# EAGLE design md_ver10.7 (EAGLE 6.4)
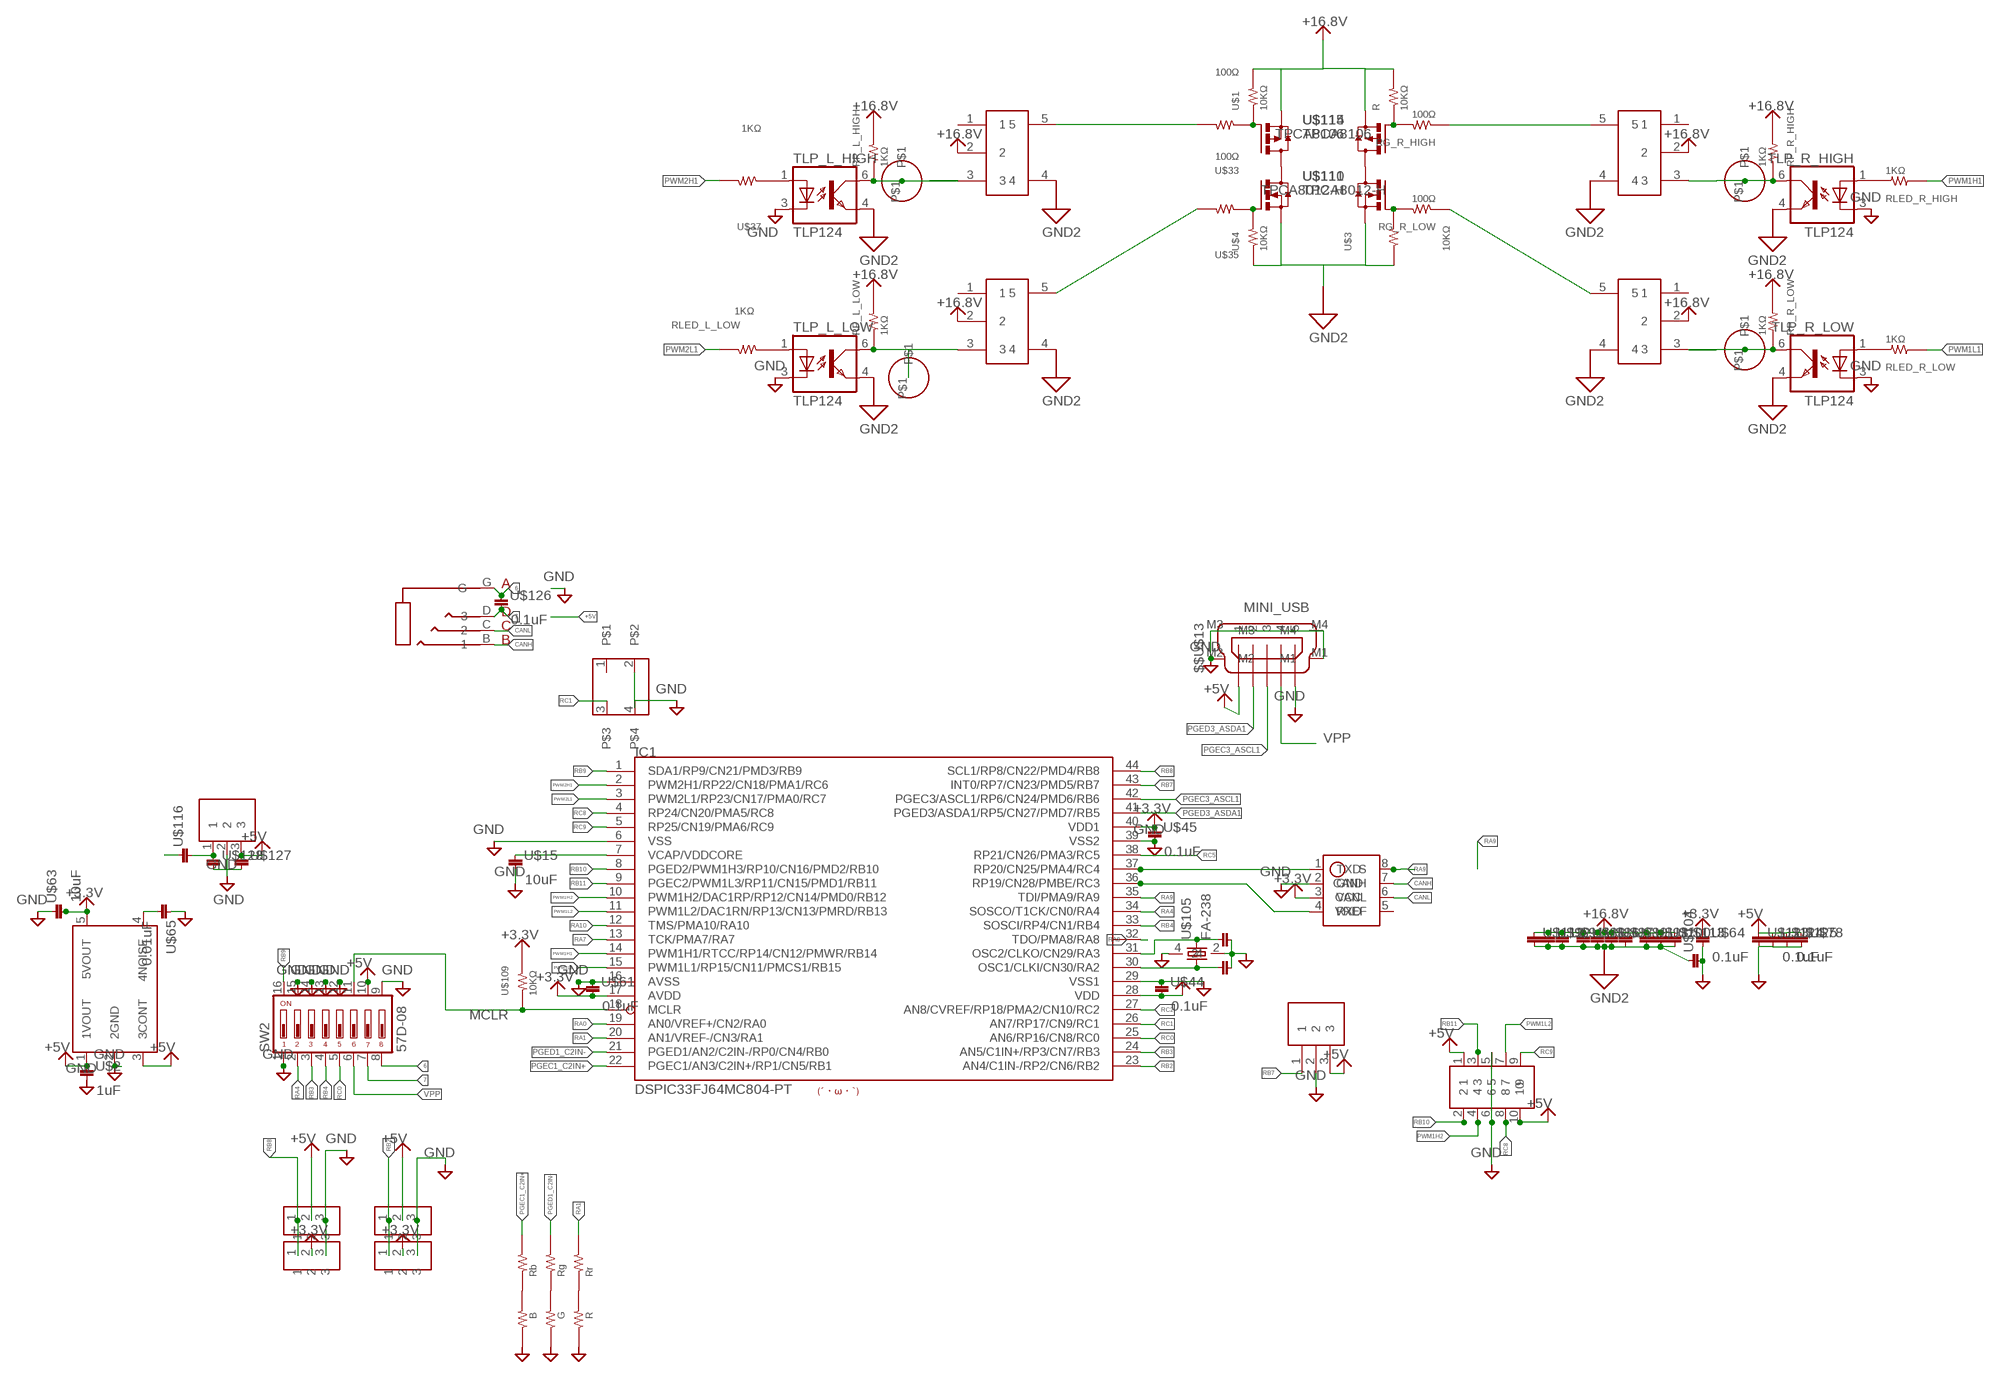
[diagram p0: schematic, sheet 1]

## Parts
$$U$5  PAD1_4MM  [PAD1_4MM]
$$U$6  PAD1_4MM  [PAD1_4MM]
$$U$13  MINI_USB  [MINI_USB]
$$U$14  AUDIO4  [AUDIO4_MJ]
$$U$102  1608  [1608]
$$U$108  Rr  RESISTOR__SMD  [1608]
IC1  DSPIC33FJ64MC804-PT  [TQFP44]
IC2  TAR5SB  [SSOP5-P-0.95]
IC3  SN65HVD1050  [SOIC8]
IC4  ＰＬ－ＩＲＭ  [ＰＬ－ＩＲＭ]
IC5  Ｒ－７８Ｅ５．０  [Ｒ－７８Ｅ５．０]
IC_L_HIGH  MCP1415  [SOT23-5L]
IC_L_LOW  MCP1415  [SOT23-5L]
IC_R_HIGH  MCP1415  [SOT23-5L]
IC_R_LOW  MCP1415  [SOT23-5L]
R  10KΩ  RESISTOR__SMD  [1608]
RG_R_HIGH  100Ω  RESISTOR__SMD  [1608]
RG_R_LOW  100Ω  RESISTOR__SMD  [1608]
RLED_L_LOW  1KΩ  RESISTOR__SMD  [1608]
RLED_R_HIGH  1KΩ  RESISTOR__SMD  [1608]
RLED_R_LOW  1KΩ  RESISTOR__SMD  [1608]
RP_L_HIGH  1KΩ  RESISTOR__SMD  [1608]
RP_L_LOW  1KΩ  RESISTOR__SMD  [1608]
RP_R_HIGH  1KΩ  RESISTOR__SMD  [1608]
RP_R_LOW  1KΩ  RESISTOR__SMD  [1608]
SW1  TACT  [TL1105]
SW2  57D-08  [57D]
TLP_L_HIGH  TLP124  [11−4C1]
TLP_L_LOW  TLP124  [11−4C1]
TLP_R_HIGH  TLP124  [11−4C1]
TLP_R_LOW  TLP124  [11−4C1]
U$1  10KΩ  RESISTOR__SMD  [1608]
U$2  1uF  1608  [1608]
U$3  10KΩ  RESISTOR__SMD  [1608]
U$4  10KΩ  RESISTOR__SMD  [1608]
U$7  PAD1_4MM  [PAD1_4MM]
U$8  PAD1_4MM  [PAD1_4MM]
U$9  PIN_HEADER_52  [PIN_HEADER_5*2]
U$10  R  RESISTOR__SMD  [1608]
U$11  G  RESISTOR__SMD  [1608]
U$12  B  RESISTOR__SMD  [1608]
U$15  10uF  2012  [2012]
U$33  100Ω  RESISTOR__SMD  [1608]
U$35  100Ω  RESISTOR__SMD  [1608]
U$37  1KΩ  RESISTOR__SMD  [1608]
U$44  0.1uF  1608  [1608]
U$45  0.1uF  1608  [1608]
U$61  0.1uF  1608  [1608]
U$63  10uF  2012  [2012]
U$64  0.1uF  1608  [1608]
U$65  0.01uF  1608  [1608]
U$69  3PIN_HALF  [3PIN_INT_HALF]
U$75  3PIN_HALF  [3PIN_INT_HALF]
U$78  1608  [1608]
U$86  3225  [3225]
U$87  3225  [3225]
U$88  3225  [3225]
U$89  3225  [3225]
U$91  1608  [1608]
U$92  1608  [1608]
U$93  1608  [1608]
U$100  1608  [1608]
U$103  1608  [1608]
U$104  2012  [2012]
U$105  FA-238  [FA-238]
U$106  Rb  RESISTOR__SMD  [1608]
U$107  Rg  RESISTOR__SMD  [1608]
U$109  10KΩ  RESISTOR__SMD  [1608]
U$110  TPCA8012-H  [2-5Q1A]
U$111  TPCA8012-H  [2-5Q1A]
U$112  1608  [1608]
U$113  1608  [1608]
U$114  TPCA8106  [2-5Q1A]
U$115  TPCA8106  [2-5Q1A]
U$116  2012  [2012]
U$117  3PIN_HALF  [3PIN_INT_HALF]
U$118  3PIN_HALF  [3PIN_INT_HALF]
U$123  1608  [1608]
U$124  0.1uF  1608  [1608]
U$125  0.1uF  1608  [1608]
U$126  0.1uF  1608  [1608]
U$127  3216  [3216]
U$128  1608  [1608]
U$129  ROGO_SYOBON  [ROGO_SYOBON]

## Nets
6: $$U$14.G SW2.8 U$126.P$1
7: $$U$14.D SW2.7 U$126.P$2
+3.3V: IC1.17(AVDD) IC1.28(VDD) IC1.40(VDD1) IC2.5(5VOUT) IC3.3(VCC) U$44.P$2 U$45.P$1 U$61.P$2 U$63.2 U$64.P$1 U$69.2 U$75.2 U$109.2
+5V: $$U$13.1 IC2.1(1VOUT) IC2.3(3CONT) IC4.3 IC5.3 SW2.10 U$2.P$1 U$9.1 U$9.10 U$78.P$1 U$117.2 U$118.2 U$123.P$1 U$124.P$1 U$125.P$1 U$127.P$1
+16.8V: IC_L_HIGH.2 IC_L_LOW.2 IC_R_HIGH.2 IC_R_LOW.2 R.2 RP_L_HIGH.2 RP_L_LOW.2 RP_R_HIGH.2 RP_R_LOW.2 U$1.2 U$86.P$1 U$87.P$1 U$88.P$1 U$89.P$1 U$91.P$1 U$92.P$1 U$93.P$1 U$100.P$1 U$112.P$1 U$113.P$1 U$114.1(S) U$114.2(S) U$114.3(S) U$115.1(S) U$115.2(S) U$115.3(S)
CANH: $$U$14.B IC3.7(CANH)
CANL: $$U$14.C IC3.6(CANL)
GND: $$U$13.5 $$U$13.M1 $$U$13.M2 $$U$13.M3 $$U$13.M4 $$U$102.P$2 IC1.6(VSS) IC1.16(AVSS) IC1.29(VSS1) IC1.39(VSS2) IC2.2(2GND) IC3.2(GND) IC4.2 IC5.2 SW1.2 SW1.4 SW2.1 SW2.9 SW2.12 SW2.13 SW2.14 SW2.15 TLP_L_HIGH.3(C) TLP_L_LOW.3(C) TLP_R_HIGH.3(C) TLP_R_LOW.3(C) U$2.P$2 U$9.5 U$9.6 U$10.1 U$11.1 U$12.1 U$15.2 U$44.P$1 U$45.P$2 U$61.P$1 U$63.1 U$64.P$2 U$65.P$1 U$69.3 U$75.3 U$78.P$2 U$103.P$2 U$104.2 U$105.2 U$105.4 U$117.3 U$118.3 U$123.P$2 U$124.P$2 U$125.P$2 U$127.P$2 U$128.P$2
GND2: IC_L_HIGH.4 IC_L_LOW.4 IC_R_HIGH.4 IC_R_LOW.4 TLP_L_HIGH.4(EMIT) TLP_L_LOW.4(EMIT) TLP_R_HIGH.4(EMIT) TLP_R_LOW.4(EMIT) U$3.1 U$4.1 U$86.P$2 U$87.P$2 U$88.P$2 U$89.P$2 U$91.P$2 U$92.P$2 U$93.P$2 U$100.P$2 U$104.1 U$110.1(S) U$110.2(S) U$110.3(S) U$111.1(S) U$111.2(S) U$111.3(S) U$112.P$2 U$113.P$2
JP1: U$116.1
M1: U$111.5(D) U$111.6(D) U$111.7(D) U$111.8(D) U$115.5(D) U$115.6(D) U$115.7(D) U$115.8(D)
M2: U$110.5(D) U$110.6(D) U$110.7(D) U$110.8(D) U$114.5(D) U$114.6(D) U$114.7(D) U$114.8(D)
MCLR: IC1.18(MCLR) SW2.11 U$109.1
N$1: U$4.2 U$35.1 U$111.4(G)
N$2: IC2.4(4NOISE) U$65.P$2
N$3: RLED_L_LOW.1 TLP_L_LOW.1(A)
N$4: RG_R_LOW.2 U$3.2 U$110.4(G)
N$5: IC_L_HIGH.5 U$33.2
N$6: $$U$6.P$1 IC_L_LOW.3 RP_L_LOW.1 TLP_L_LOW.6(COL)
N$7: IC_R_LOW.5 RG_R_LOW.1
N$9: RLED_R_LOW.1 TLP_R_LOW.1(A)
N$10: TLP_L_HIGH.1(A) U$37.1
N$11: $$U$5.P$1 IC_L_HIGH.3 RP_L_HIGH.1 TLP_L_HIGH.6(COL)
N$12: $$U$102.P$1 IC1.30(OSC1/CLKI/CN30/RA2) U$105.1
N$13: IC5.1 U$116.2 U$128.P$1
N$14: IC_L_LOW.5 U$35.2
N$15: IC_R_HIGH.3 RP_R_HIGH.1 TLP_R_HIGH.6(COL) U$8.P$1
N$16: RLED_R_HIGH.1 TLP_R_HIGH.1(A)
N$18: IC_R_HIGH.5 RG_R_HIGH.1
N$19: U$1.1 U$33.1 U$115.4(G)
N$20: R.1 RG_R_HIGH.2 U$114.4(G)
N$21: U$12.2 U$106.1
N$23: IC1.31(OSC2/CLKO/CN29/RA3) U$103.P$1 U$105.3
N$24: U$11.2 U$107.1
N$25: $$U$108.1 U$10.2
N$27: IC1.37(RP20/CN25/PMA4/RC4) IC3.1(TXD)
N$30: IC1.36(RP19/CN28/PMBE/RC3) IC3.4(RXD)
PGEC1_C2IN+: IC1.22(PGEC1/AN3/C2IN+/RP1/CN5/RB1) U$106.2
PGEC3_ASCL1: $$U$13.3 IC1.42(PGEC3/ASCL1/RP6/CN24/PMD6/RB6)
PGED1_C2IN-: IC1.21(PGED1/AN2/C2IN-/RP0/CN4/RB0) U$107.2
PGED3_ASDA1: $$U$13.2 IC1.41(PGED3/ASDA1/RP5/CN27/PMD7/RB5)
PWM1H1: IC1.14(PWM1H1/RTCC/RP14/CN12/PMWR/RB14) RLED_R_HIGH.2
PWM1H2: IC1.10(PWM1H2/DAC1RP/RP12/CN14/PMD0/RB12) U$9.4
PWM1L1: IC1.15(PWM1L1/RP15/CN11/PMCS1/RB15) RLED_R_LOW.2
PWM1L2: IC1.11(PWM1L2/DAC1RN/RP13/CN13/PMRD/RB13) U$9.7
PWM2H1: IC1.2(PWM2H1/RP22/CN18/PMA1/RC6) U$37.2
PWM2L1: IC1.3(PWM2L1/RP23/CN17/PMA0/RC7) RLED_L_LOW.2
RA0: IC1.19(AN0/VREF+/CN2/RA0)
RA1: $$U$108.2 IC1.20(AN1/VREF-/CN3/RA1)
RA4: IC1.34(SOSCO/T1CK/CN0/RA4) SW2.2
RA7: IC1.13(TCK/PMA7/RA7)
RA8: IC1.32(TDO/PMA8/RA8)
RA9: IC1.35(TDI/PMA9/RA9) IC3.8(S)
RA10: IC1.12(TMS/PMA10/RA10)
RB2: IC1.23(AN4/C1IN-/RP2/CN6/RB2) U$75.1 U$118.1
RB3: IC1.24(AN5/C1IN+/RP3/CN7/RB3) SW2.3
RB4: IC1.33(SOSCI/RP4/CN1/RB4) SW2.4
RB7: IC1.43(INT0/RP7/CN23/PMD5/RB7) IC4.1
RB8: IC1.44(SCL1/RP8/CN22/PMD4/RB8) U$69.1 U$117.1
RB9: IC1.1(SDA1/RP9/CN21/PMD3/RB9) SW2.16
RB10: IC1.8(PGED2/PWM1H3/RP10/CN16/PMD2/RB10) U$9.2
RB11: IC1.9(PGEC2/PWM1L3/RP11/CN15/PMD1/RB11) U$9.3
RC0: IC1.25(AN6/RP16/CN8/RC0) SW2.5
RC1: IC1.26(AN7/RP17/CN9/RC1) SW1.3
RC2: IC1.27(AN8/CVREF/RP18/PMA2/CN10/RC2)
RC5: IC1.38(RP21/CN26/PMA3/RC5)
RC8: IC1.4(RP24/CN20/PMA5/RC8) U$9.8
RC9: IC1.5(RP25/CN19/PMA6/RC9) U$9.9
TLP_R_LOW: IC_R_LOW.3 RP_R_LOW.1 TLP_R_LOW.6(COL) U$7.P$1
VCAP/VDDCORE: IC1.7(VCAP/VDDCORE) U$15.1
VPP: $$U$13.4 SW2.6
Unconnected: IC3.5(VREF) IC_L_HIGH.1 IC_L_LOW.1 IC_R_HIGH.1 IC_R_LOW.1 SW1.1

## Library data of the parts
$$U$5 $$U$6 U$7 U$8 = 08_CONECTOR:PAD1_4MM
$$U$13 = 08_CONECTOR:MINI_USB
$$U$14 = 08_CONECTOR:AUDIO4
$$U$102 U$2 U$44 U$45 U$61 U$64 U$65 U$78 U$91-U$93 U$100 U$103 U$112 U$113 U$123-U$126 U$128 = 02_C:1608
$$U$108 R RG_R_HIGH RG_R_LOW RLED_L_LOW RLED_R_HIGH RLED_R_LOW RP_L_HIGH RP_L_LOW RP_R_HIGH RP_R_LOW U$1 U$3 U$4 U$10-U$12 U$33 U$35 U$37 U$106 U$107 U$109 = 01_R:RESISTOR__SMD
IC1 = microchip-dspic33fjxxmc:DSPIC33FJ64MC804: dsPIC33FJ32MC302/304, dsPIC33FJ64MCX02/X04, AND dsPIC33FJ128MCX02/X04 High-Performance, 16-bit Digital Signal Controllers Package:44 Pin TQFP Operating Range: * Up to 40 MIPS operation (at 3.0V -3.6V): - Industrial temperature range (-40°C to +85°C) - Extended temperature range (-40°C to +125°C) High-Performance DSC CPU: * Modified Harvard architecture * C compiler optimized instruction set * 16-bit wide data path * 24-bit wide instructions * Linear program memory addressing up to 4M instruction words * Linear data memory addressing up to 64 Kbytes * 83 base instructions: mostly 1 word/1 cycle * Two 40-bit accumulators with rounding and saturation options * Flexible and powerful addressing modes: - Indirect - Modulo - Bit-Reversed * Software stack * 16 x 16 fractional/integer multiply operations * 32/16 and 16/16 divide operations * Single-cycle multiply and accumulate: - Accumulator write back for DSP operations - Dual data fetch * Up to ±16-bit shifts for up to 40-bit data Direct Memory Access (DMA): * 8-channel hardware DMA * Up to 2 Kbytes dual ported DMA buffer area (DMA RAM) to store data transferred via DMA: - Allows data transfer between RAM and a peripheral while CPU is executing code (no cycle stealing) * Most peripherals support DMA Timers/Capture/Compare/PWM: * Timer/Counters, up to five 16-bit timers: - Can pair up to make two 32-bit timers - One timer runs as a Real-Time Clock with an external 32.768 kHz oscillator - Programmable prescaler * Input Capture (up to four channels): - Capture on up, down or both edges - 16-bit capture input functions - 4-deep FIFO on each capture * Output Compare (up to four channels): - Single or Dual 16-bit Compare mode - 16-bit Glitchless PWM mode * Hardware Real-Time Clock/Calendar (RTCC): - Provides clock, calendar, and alarm functions Interrupt Controller: * 5-cycle latency * Up to 53 available interrupt sources * Up to three external interrupts * Seven programmable priority levels * Five processor exceptions Digital I/O: * Peripheral pin Select functionality * Up to 35 programmable digital I/O pins * Wake-up/Interrupt-on-Change for up to 31 pins * Output pins can drive from 3.0V to 3.6V * Up to 5V output with open drain configuration * All digital input pins are 5V tolerant * 4 mA sink on all I/O pins On-Chip Flash and SRAM: * Flash program memory (up to 128 Kbytes) * Data SRAM (up to 16 Kbytes) * Boot, Secure, and General Security for program Flash System Management: * Flexible clock options: - External, crystal, resonator, internal RC - Fully integrated Phase-Locked Loop (PLL) - Extremely low jitter PLL * Power-up Timer * Oscillator Start-up Timer/Stabilizer * Watchdog Timer with its own RC oscillator * Fail-Safe Clock Monitor * Reset by multiple sources Power Management: * On-chip 2.5V voltage regulator * Switch between clock sources in real time * Idle, Sleep, and Doze modes with fast wake-up Analog-to-Digital Converters (ADCs): * 10-bit, 1.1 Msps or 12-bit, 500 Ksps conversion: - Two and four simultaneous samples (10-bit ADC) - Up to nine input channels with auto-scanning - Conversion start can be manual or synchronized with one of four trigger sources - Conversion possible in Sleep mode - ±2 LSb max integral nonlinearity - ±1 LSb max differential nonlinearity Audio Digital-to-Analog Converter (DAC): - 16-bit Dual Channel DAC module - 100 Ksps maximum sampling rate - Second-Order Digital Delta-Sigma Modulator Comparator Module: * Two analog comparators with programmable input/output configuration CMOS Flash Technology: * Low-power, high-speed Flash technology * Fully static design * 3.3V (±10%) operating voltage * Industrial and Extended temperature * Low power consumption Motor Control Peripherals: * 6-channel 16-bit Motor Control PWM: - Three duty cycle generators - Independent or Complementary mode - Programmable dead-time and output polarity - Edge-aligned or center-aligned - Manual output override control - One Fault input - Trigger for ADC conversions - PWM frequency for 16-bit resolution (@ 40 MIPS) = 1220 Hz for Edge-Aligned mode, 610 Hz for Center-Aligned mode - PWM frequency for 11-bit resolution (@ 40 MIPS) = 39.1 kHz for Edge-Aligned mode, 19.55 kHz for Center-Aligned mode * 2-channel 16-bit Motor Control PWM: - One duty cycle generator - Independent or Complementary mode - Programmable dead time and output polarity - Edge-aligned or center-aligned - Manual output override control - One Fault input - Trigger for ADC conversions - PWM frequency for 16-bit resolution (@ 40 MIPS) = 1220 Hz for Edge-Aligned mode, 610 Hz for Center-Aligned mode - PWM frequency for 11-bit resolution (@ 40 MIPS) = 39.1 kHz for Edge-Aligned mode, 19.55 kHz for Center-Aligned mode * 2-Quadrature Encoder Interface module: - Phase A, Phase B, and index pulse input - 16-bit up/down position counter - Count direction status - Position Measurement (x2 and x4) mode - Programmable digital noise filters on inputs - Alternate 16-bit Timer/Counter mode - Interrupt on position counter rollover/underflow
IC2 = 04_IC:TAR5SB
IC3 = 04_IC:SN65HVD1050
IC4 = 04_IC:ＰＬ－ＩＲＭ
IC5 = 04_IC:Ｒ－７８Ｅ５．０
IC_L_HIGH IC_L_LOW IC_R_HIGH IC_R_LOW = 04_IC:MCP1415
SW1 = switch:TACT
SW2 = 09_1_switch:57D-08
TLP_L_HIGH TLP_L_LOW TLP_R_HIGH TLP_R_LOW = 04_IC:TLP124
U$9 = 08_CONECTOR:PIN_HEADER_5*2
U$15 U$63 U$104 U$116 = 02_C:2012
U$69 U$75 U$117 U$118 = 08_CONECTOR:3PIN_HALF
U$86-U$89 = 02_C:3225
U$105 = 09_2_CRYSTAL:FA-238
U$110 U$111 = 06_FET:TPCA8012-H
U$114 U$115 = 06_FET:TPCA8106
U$127 = 02_C:3216
U$129 = 0A_ROGO:ROGO_SYOBON

## Net classes
0 default: clearance 0.2 mm

## Board
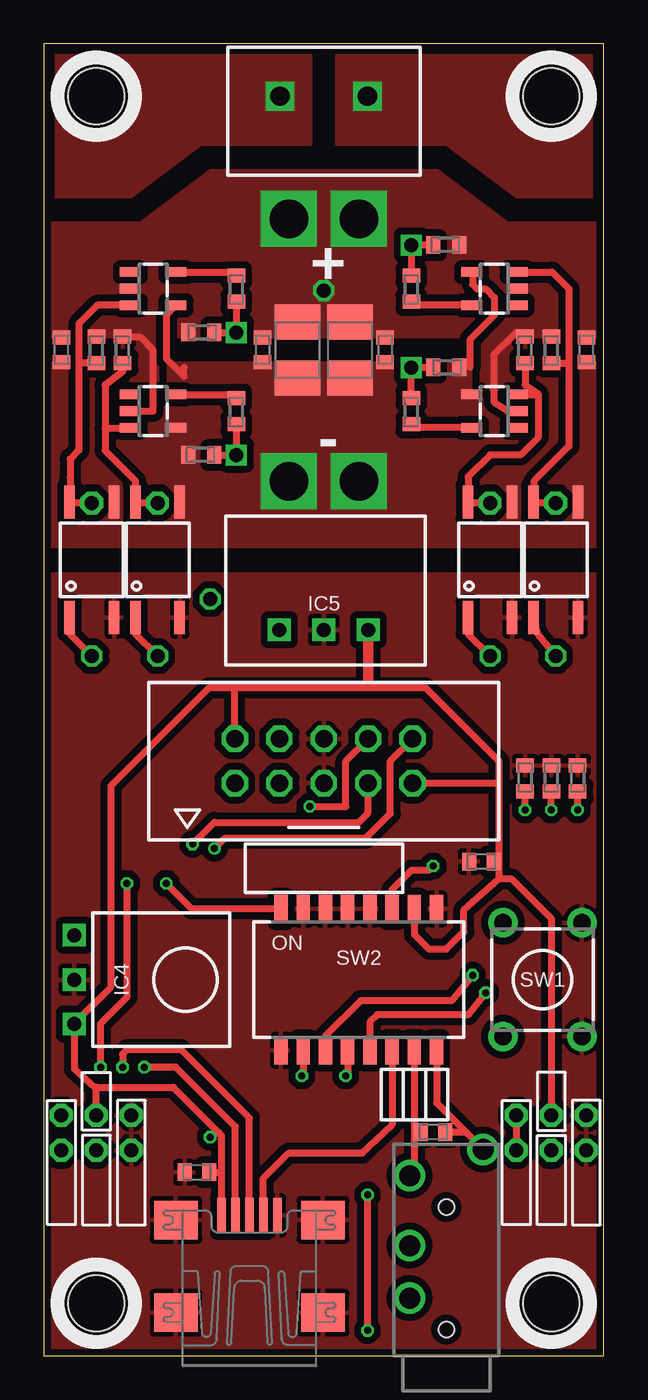
[diagram p1: board, top side]
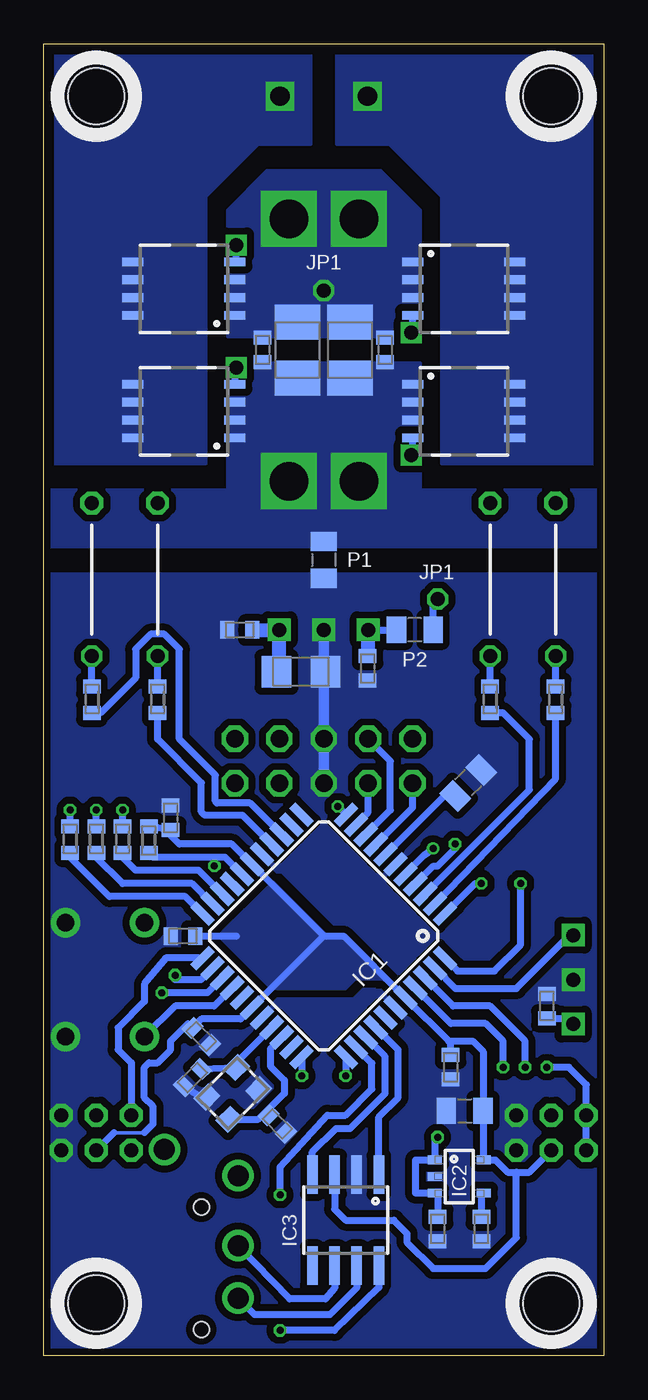
[diagram p2: board, bottom side, seen from below]

Size 32 x 75 mm. Coordinates in mm from the lower left corner, seen from the top.
Outline: 0,0 32,0 32,75 0,75 0,0
Copper layers (1*16): Top 0.035mm / dielectric 1.5mm / Bottom 0.035mm
Design rules "Fusion_eagle_rule_v1.1": minimum track width 6mil, minimum drill 12mil, track to track 6mil, track to pad 6mil, pad to pad 6mil, via to via 6mil, smd to smd 0mil, copper to edge 10mil, drill to drill 10mil, minimum pad ring 10mil, minimum via ring 6mil, stop-mask expansion 2mil, vias tented up to drill 100mil, thermal gap 10mil
Holes 3.2 mm at 3,3 29,3 3,72 29,72

### Footprints (pad centres in the part's own frame; a part is rotated, then mirrored left to right if it is on the bottom)
PAD1_4MM = drill 0.8 octagon: P$1 0,0
MINI_USB = smd 2 x 0.5: 1 3.52,1.6; 2 3.52,0.8; 3 3.52,0; 4 3.52,-0.8; 5 3.52,-1.6 | smd 2.2 x 2.5: M1 -2.03,-4.2; M2 -2.03,4.2; M3 3.27,4.2; M4 3.27,-4.2
AUDIO4_MJ = drill 1.2: B 3.3,2.1; C 6.3,2.1; D 10.3,2.1; G 11.8,-2.1 | hole 0.9: 1.5,0; 8.5,0
1608 = smd 0.8 x 1: P$1 -0.7,0; P$2 0.7,0
1608' = smd 0.8 x 1: 1 -0.75,0; 2 0.75,0
TQFP44 = smd 1.5 x 0.5: 1 -5.8,4; 2 -5.8,3.2; 3 -5.8,2.4; 4 -5.8,1.6; 5 -5.8,0.8; 6 -5.8,0; 7 -5.8,-0.8; 8 -5.8,-1.6; 9 -5.8,-2.4; 10 -5.8,-3.2; 11 -5.8,-4; 23 5.8,-4; 24 5.8,-3.2; 25 5.8,-2.4; 26 5.8,-1.6; 27 5.8,-0.8; 28 5.8,0; 29 5.8,0.8; 30 5.8,1.6; 31 5.8,2.4; 32 5.8,3.2; 33 5.8,4 | smd 0.5 x 1.5: 12 -4,-5.8; 13 -3.2,-5.8; 14 -2.4,-5.8; 15 -1.6,-5.8; 16 -0.8,-5.8; 17 0,-5.8; 18 0.8,-5.8; 19 1.6,-5.8; 20 2.4,-5.8; 21 3.2,-5.8; 22 4,-5.8; 34 4,5.8; 35 3.2,5.8; 36 2.4,5.8; 37 1.6,5.8; 38 0.8,5.8; 39 0,5.8; 40 -0.8,5.8; 41 -1.6,5.8; 42 -2.4,5.8; 43 -3.2,5.8; 44 -4,5.8
SSOP5-P-0.95 = smd 0.5 x 0.8: 1 -0.95,-1.4; 2 0,-1.4; 3 0.95,-1.4; 4 0.95,1.4; 5 -0.95,1.4
SOIC8 = smd 0.6 x 2.2: 1 -1.905,-2.6; 2 -0.635,-2.6; 3 0.635,-2.6; 4 1.905,-2.6; 5 1.905,2.6; 6 0.635,2.6; 7 -0.635,2.6; 8 -1.905,2.6
ＰＬ－ＩＲＭ = drill 0.8 square: 1 -2.54,0; 2 0,0; 3 2.54,0
Ｒ－７８Ｅ５．０ = drill 0.8 square: 1 -2.54,0; 2 0,0; 3 2.54,0
SOT23-5L = smd 0.55 x 1.2: 1 -0.95,-1.3; 2 0,-1.3; 3 0.95,-1.3; 4 0.95,1.3; 5 -0.95,1.3
TL1105 = drill 1 pad 1.676: 1 -2.25,3.25; 2 2.25,3.25; 3 -2.25,-3.25; 4 2.25,-3.25
57D = smd 0.76 x 1.58: 1 -4.445,-4.045; 2 -3.175,-4.045; 3 -1.905,-4.045; 4 -0.635,-4.045; 5 0.635,-4.045; 6 1.905,-4.045; 7 3.175,-4.045; 8 4.445,-4.045; 9 4.445,4.045; 10 3.175,4.045; 11 1.905,4.045; 12 0.635,4.045; 13 -0.635,4.045; 14 -1.905,4.045; 15 -3.175,4.045; 16 -4.445,4.045
11−4C1 = smd 0.6 x 1.9: 1 -1.27,-3.3; 3 1.27,-3.3; 4 1.27,3.3; 6 -1.27,3.3
PIN_HEADER_5*2 = drill 1 octagon: 1 -5.08,1.27; 2 -5.08,-1.27; 3 -2.54,1.27; 4 -2.54,-1.27; 5 0,1.27; 6 0,-1.27; 7 2.54,1.27; 8 2.54,-1.27; 9 5.08,1.27; 10 5.08,-1.27
2012 = smd 1.1 x 1.5: 1 -1.05,0; 2 1.05,0
3PIN_INT_HALF = drill 0.8 octagon: 1 -2,0; 2 0,0; 3 2,0
3225 = smd 2 x 2.6: P$1 -1.6,0; P$2 1.6,0
FA-238 = smd 1.2 x 1: 1 -1.2,-0.9; 2 1.2,-0.9; 3 1.2,0.9; 4 -1.2,0.9
2-5Q1A = smd 0.5 x 1.2: 1 -1.524,-2.921; 2 -0.508,-2.921; 3 0.508,-2.921; 4 1.524,-2.921; 5 1.524,2.921; 6 0.508,2.921; 7 -0.508,2.921; 8 -1.524,2.921
3216 = smd 1.7 x 1.8: P$1 -1.4,0; P$2 1.4,0

### Placement (x,y rotation side)
$$U$5  2.75,48.75 0 top
$$U$6  6.5,48.75 0 top
$$U$13  11.75,4.5 90 top
$$U$14  23,0 90 top
$$U$102  23.5,15.9 225 bottom
$$U$108  Rr  [1608']  27.5,29.5 270 bottom
IC1  16,24 225 bottom
IC2  8.25,10.25 270 bottom
IC3  14.75,7.75 180 bottom
IC4  1.75,21.5 270 top
IC5  16,41.5 0 top
IC_L_HIGH  6.25,61 270 top
IC_L_LOW  6.25,54 270 top
IC_R_HIGH  25.75,61 90 top
IC_R_LOW  25.75,54 90 top
R  10KΩ  [1608']  23,63.5 0 top
RG_R_HIGH  100Ω  [1608']  21,61 90 top
RG_R_LOW  100Ω  [1608']  21,54 90 top
RLED_L_LOW  1KΩ  [1608']  6.5,37.5 270 bottom
RLED_R_HIGH  1KΩ  [1608']  29.25,37.5 270 bottom
RLED_R_LOW  1KΩ  [1608']  25.5,37.5 270 bottom
RP_L_HIGH  1KΩ  [1608']  3,57.5 90 top
RP_L_LOW  1KΩ  [1608']  4.5,57.5 90 top
RP_R_HIGH  1KΩ  [1608']  29,57.5 90 top
RP_R_LOW  1KΩ  [1608']  27.5,57.5 90 top
SW1  28.5,21.5 0 top
SW2  18,21.5 0 top
TLP_L_HIGH  2.75,45.5 0 top
TLP_L_LOW  6.5,45.5 0 top
TLP_R_HIGH  29.25,45.5 0 top
TLP_R_LOW  25.5,45.5 0 top
U$1  10KΩ  [1608']  9,58.5 180 top
U$2  9.5,7.25 270 bottom
U$3  10KΩ  [1608']  23,56.5 180 top
U$4  10KΩ  [1608']  9,51.5 0 top
U$7  25.5,48.75 0 top
U$8  29.25,48.75 0 top
U$9  16,34 0 top
U$10  R  [1608']  27.5,33 270 top
U$11  G  [1608']  29,33 270 top
U$12  B  [1608']  30.5,33 270 top
U$15  7.75,32.75 45 bottom
U$33  100Ω  [1608']  11,61 90 top
U$35  100Ω  [1608']  11,54 90 top
U$37  1KΩ  [1608']  2.75,37.5 270 bottom
U$44  23,18.25 135 bottom
U$45  8.75,16.5 270 bottom
U$61  24.75,30.75 270 bottom
U$63  7.95,14 0 bottom
U$64  24.05,24 180 bottom
U$65  7,7.25 90 bottom
U$69  3,11.75 0 top
U$75  29,11.75 0 top
U$78  20.8,41.5 180 bottom
U$86  17.5,57.5 270 bottom
U$87  14.5,57.5 270 bottom
U$88  17.5,57.5 270 top
U$89  14.5,57.5 270 top
U$91  19.5,57.5 270 top
U$92  12.5,57.5 270 top
U$93  12.5,57.5 270 bottom
U$100  19.5,57.5 270 bottom
U$103  18.65,13.25 315 bottom
U$104  16,45.5 270 bottom
U$105  21.2,15 225 bottom
U$106  Rb  [1608']  30.5,29.5 270 bottom
U$107  Rg  [1608']  29,29.5 270 bottom
U$109  10KΩ  [1608']  26,29.5 90 bottom
U$110  24,54 90 bottom
U$111  8,54 270 bottom
U$112  1,57.5 270 top
U$113  31,57.5 270 top
U$114  24,61 90 bottom
U$115  8,61 270 bottom
U$116  10.8,41.5 180 bottom
U$117  3,13.75 0 top
U$118  29,13.75 0 top
U$123  8.75,10.5 180 top
U$124  3.25,20 90 bottom
U$125  25,28.25 180 top
U$126  22.25,12.8 180 top
U$127  17.3,39.1 0 bottom
U$128  13.5,39.3 270 bottom
U$129  13,44.7 0 top

### Tracks (layer width: path | path; a pad name or v marks a point on that pad's centre or on a via)
6
  Top 0.4: 23.82,13.07 22.45,14.46 SW2.8 | 23.82,13.07 $$U$14.G | U$126.P$1 24.05,12.8 23.82,13.07
7
  Top 0.4: 21.18,13 21.18,10.57 $$U$14.D | U$126.P$2 21.18,13 | SW2.7 21.18,13
+3.3V
  Bottom 0.2: 28,12.75 26.25,12.75
  Bottom 0.4: 16,24 IC1.28 20.75,19.25 23,19.25 23.25,19 U$44.P$2 23.75,19 24.75,18 24.75,17.5 25.5,16.75 26,16.75 26.25,16.5 26.25,14.75 25.75,14.25 25.75,13.25 26.25,12.75 | 16,24 IC1.17 | IC1.17 | 16,24 14.87,24 IC1.40 8.87,18 8.75,18 | U$64.P$1 21,24 | U$75.2 28,12.75 | 8.75,18 7.5,18 6.9,17.4 U$63.2 6.85,13.7 IC2.5 6.2,11.2 5.5,10.5 5,10.5 | 5,10.5 4.25,10.5 U$69.2 | IC3.3 15.38,8.38 14.75,7.75 12,7.75 11.25,7 11.25,6.5 9.75,5 6.75,5 5,6.75 5,10.5 | IC1.17 21.25,29.25 24.25,29.25 24.75,29.75 U$61.P$2 U$109.2 | U$45.P$1 8.75,18
  pour Bottom (isolate 0.4): 22,24 18.9,27.1 15.7,23.9 14.9,23.9 12.5,21.5 12.55,21.45 12.65,21.55 14.2,21.55 14.75,21 19,21
+5V  (via drill 0.4)
  Top 0.4: 3,15.35 2.9,15.35 1.75,16.4 IC4.3 1.75,19 3.85,21.1 3.85,32.6 9.45,38.2 11,38.2 | 3,15.35 7.4,15.35 10,12.75 | 10.15,10.5 10.15,12.6 10,12.75 | 10.15,10.5 $$U$13.1 | 11,38.2 18.5,38.2 | 18.5,38.2 21.8,38.2 26,34 26,32.75 | 26,32.75 26,28.25 | 26,28.25 26,27.25 | 26,27.25 24,25.5 24,24.25 23,23.25 22,23.25 21.18,24.07 SW2.10 | U$118.2 29,25 26.75,27.25 26,27.25 | U$9.10 25.98,32.73 26,32.75 | U$9.1 10.92,38.12 11,38.2 | U$117.2 3,15.35 | 10,12.75 v9.5,12.5 | U$125.P$1 26,28.25 | U$123.P$1 10.15,10.5 | 18.54,38.54 18.5,38.2
  Top 0.6: IC5.3 18.54,38.54
  Bottom 0.4: U$2.P$1 9.5,9.15 IC2.3 10.75,9.3 10.75,11.2 IC2.1 9.65,12.35 v9.5,12.5 | U$124.P$1 1.84,19.3 IC4.3
  Bottom 0.8: U$127.P$1 18.54,39.1 IC5.3 U$78.P$1
+16.8V  (via drill 0.8, 2.2)
  Top 0.4: IC_L_LOW.2 6.25,54 6.25,57.5 5.5,58.25 RP_L_LOW.2 | IC_R_LOW.2 26.5,54 25.75,54.5 25.75,57.25 27,58.5
  other vias: 18,65 14,65 16,60.9
  pour Bottom (isolate 0.4, rank 2, no thermals): 12.75,67.75 19.25,67.75 21.5,65.5 21.5,58.25 10.5,58.25 10.5,65.5
  pour Top (isolate 0.4, rank 2, no thermals): 0.1,58.25 31.9,58.25 31.9,64.75 26.5,64.75 22.5,67.75 9.5,67.75 5.5,64.75 0.1,64.75
  pour Top (isolate 0.4): 4.25,58.25 4.25,55.75 6.5,55.75 6.5,58.25
  pour Top (isolate 0.4): 25,58.25 25,55.25 28,55.25 28,58.25
CANH
  Bottom 0.4: IC3.7 14.12,3.88 15.65,2.35 19.95,2.35 $$U$14.B
CANL
  Bottom 0.4: IC3.6 15.38,3.87 15.9,3.25 17.95,3.25 $$U$14.C
GND
  Bottom 0.4: $$U$102.P$2 23.03,14.79
  Bottom 0.6: IC5.2 U$9.5 U$9.6
  pour Top (isolate 0.4): 0.1,44.7 31.9,44.7 31.9,0.1 0.1,0.1
  pour Bottom (isolate 0.4, rank 2, no thermals): 0.1,44.7 31.9,44.7 31.9,0.1 0.1,0.1
GND2  (via drill 2.2)
  Top 0.4: IC_L_HIGH.4 7,59.5 7,57 8,56 8,56.5 | 24.5,61.9 24.5,61.25 24.75,61 25.25,61 25.75,60.5 25.75,59.5 24.35,58.1 24.35,56.5
  Top 0.5: IC_R_HIGH.4 24.5,61.9
  other vias: 18,50 14,50
  pour Bottom (isolate 0.4, no thermals): 31.9,46.25 0.1,46.25 0,49.5 10.5,49.5 10.5,56.75 21.5,56.75 21.5,49.5 32,49.5
  pour Top (isolate 0.4, rank 2, no thermals): 0.1,56.75 31.9,56.75 31.9,46.25 0.1,46.25
JP1  (via drill 0.8)
  Bottom 0.4: U$116.1 9.75,43 v9.5,43.25
M1  (via drill 1.1)
  other vias: 13.5,72
  pour Bottom (isolate 0.6, no thermals): 0.1,74.9 15.25,74.9 15.25,69.25 12.25,69.25 9.25,66.25 9.25,51 0.1,51
  pour Top (isolate 0.6, no thermals): 0.1,74.9 15.25,74.9 15.25,69.25 9,69.25 5,66.25 0.1,66.25
M2  (via drill 1.1)
  other vias: 18.5,72
  pour Bottom (isolate 0.6, no thermals): 22.75,51 22.75,66.25 19.75,69.25 16.75,69.25 16.75,74.9 31.9,74.9 31.9,51
  pour Top (isolate 0.6, no thermals): 16.75,74.9 31.9,74.9 31.9,66.25 27,66.25 23,69.25 16.75,69.25
MCLR  (via drill 0.4)
  Top 0.4: v22.25,28 22,27.75 21,27.75 19.91,26.66 SW2.11
  Bottom 0.4: IC1.18 21.63,28.5 22.25,28.5 | 22.25,28.5 25.75,28.5 U$109.1 | v22.25,28 22.25,28.5
N$1  (via drill 0.8)
  Top 0.4: U$35.1 v11,51.5
  Top 0.406: U$4.2 v11,51.5
  Bottom 0.406: v11,51.5 10.92,51.58 U$111.4
N$2
  Bottom 0.4: IC2.4 7,9.15 U$65.P$2
N$3  (via drill 0.8)
  Top 0.406: v6.5,40 5.23,41.27 TLP_L_LOW.1
  Bottom 0.406: RLED_L_LOW.1 v6.5,40
N$4  (via drill 0.8)
  Top 0.4: U$3.2 v21,56.5
  Top 0.406: RG_R_LOW.2 v21,56.5
  Bottom 0.406: v21,56.5 21.08,56.42 U$110.4
N$5
  Top 0.4: IC_L_HIGH.5 10.9,61.95 10.9,61.85 U$33.2
N$6
  Top 0.4: $$U$6.P$1 5.28,48.75 TLP_L_LOW.6 5.23,50.02 3.5,51.75 3.5,53 | RP_L_LOW.1 4.5,56.25 3.5,55.5 3.5,53 | IC_L_LOW.3 4.9,53 3.5,53
N$7
  Top 0.406: IC_R_LOW.5 21,53.05 RG_R_LOW.1
N$9  (via drill 0.8)
  Top 0.406: v25.5,40 24.23,41.27 TLP_R_LOW.1
  Bottom 0.406: RLED_R_LOW.1 v25.5,40
N$10  (via drill 0.8)
  Top 0.4: v2.75,40 1.48,41.27 TLP_L_HIGH.1
  Bottom 0.4: U$37.1 v2.75,40
N$11
  Top 0.4: $$U$5.P$1 1.53,48.75 TLP_L_HIGH.6 1.5,50.2 1.5,51.27 2,51.77 2,56.75 | IC_L_HIGH.3 3.05,60.05 2,59 2,56.75 | RP_L_HIGH.1 2,56.75
N$12
  Bottom 0.2: U$105.1 20.99,16.75
  Bottom 0.4: IC1.30 20.99,16.75 | $$U$102.P$1 U$105.1
N$13
  Bottom 0.4: IC5.1 U$116.2
  Bottom 0.8: U$128.P$1 13.46,40 IC5.1
N$14
  Top 0.4: IC_L_LOW.5 10.8,54.95 U$35.2
N$15
  Top 0.4: U$8.P$1 28.28,48.75 TLP_R_HIGH.6 28,48.82 28,50 30,52 30,56.75 | IC_R_HIGH.3 29.05,61.95 30,61 30,56.75 | RP_R_HIGH.1 30,56.75
N$16  (via drill 0.8)
  Top 0.406: v29.25,40 28.23,41.27 TLP_R_HIGH.1
  Bottom 0.406: RLED_R_HIGH.1 v29.25,40
N$18
  Top 0.406: IC_R_HIGH.5 21.1,60.05 RG_R_HIGH.1
N$19  (via drill 0.8)
  Top 0.4: U$33.1 v11,58.5
  Top 0.406: U$1.1 v11,58.5
  Bottom 0.406: 11,59.48 U$115.4 10.92,58.67 v11,58.5
N$20  (via drill 0.8)
  Top 0.406: RG_R_HIGH.2 v21,63.5 R.1
  Bottom 0.406: U$114.4 21,62.6 v21,63.5
N$21  (via drill 0.4)
  Top 0.406: v30.5,31.2 U$12.2
  Bottom 0.4: U$106.1 v30.5,31.2
N$23
  Bottom 0.4: IC1.31 19.05,17.56 19.05,16.55 18.25,15.75 18.25,15 19,14.24 | U$105.3 19.73,13.52 19,14.24 | U$103.P$1 19,14.24
N$24  (via drill 0.4)
  Top 0.4: v29,31.2 U$11.2
  Bottom 0.4: U$107.1 v29,31.2
N$25  (via drill 0.4)
  Top 0.4: v27.5,31.2 U$10.2
  Bottom 0.4: $$U$108.1 v27.5,31.2
N$27
  Bottom 0.4: IC3.1 12.85,13.65 11.75,14.75 11.75,17.49 IC1.37
N$30
  Bottom 0.4: IC3.4 16.66,11.64 15.3,13 14.5,13 12.5,15 12.5,17.11 IC1.36
PGEC1_C2IN+
  Bottom 0.4: IC1.22 23.91,26.25 28.25,26.25 30.5,28.5 U$106.2
PGEC3_ASCL1  (via drill 0.4)
  Top 0.4: $$U$13.3 11.75,13.6 7.85,17.5 4.75,17.5 4.5,17.25 v4.5,16.5
  Bottom 0.4: v4.5,16.5 4.5,18 6.5,20 8.61,20 IC1.42
PGED1_C2IN-
  Bottom 0.4: IC1.21 23.52,27 27.5,27 29,28.5 U$107.2
PGED3_ASDA1  (via drill 0.4)
  Top 0.4: $$U$13.2 10.95,13.1 7.55,16.5 v5.75,16.5
  Bottom 0.4: v5.75,16.5 5.75,18 6.75,19 8.74,19 IC1.41
PWM1H1
  Bottom 0.4: IC1.14 20.21,31.6 22.1,31.6 22.2,31.7 22.2,33.2 24.25,35.25 24.25,40.4 25.1,41.25 25.9,41.25 26.75,40.4 26.75,38.75 28.75,36.75 RLED_R_HIGH.2 29.15,36.75
PWM1H2
  Bottom 0.4: IC1.10 13.46,31.07 U$9.4
PWM1L1
  Bottom 0.4: IC1.15 20.64,30.9 22.8,30.9 23,31.1 23,32.75 25.5,35.25 RLED_R_LOW.2
PWM1L2  (via drill 0.4)
  Top 0.4: v15.2,31.4 17.27,31.4 17.27,34 U$9.7
  Bottom 0.4: IC1.11 v15.2,31.4
PWM2H1
  Bottom 0.4: U$37.2 2.75,32.98 IC1.2
PWM2L1
  Bottom 0.4: IC1.3 4.25,32.36 4.25,35.25 5.75,36.75 RLED_L_LOW.2
RA1
  Bottom 0.4: IC1.20 23.14,27.75 26.75,27.75 27.5,28.5 $$U$108.2
RA4  (via drill 0.4)
  Top 0.4: 14.82,16 v14.75,16 14.82,16.07 SW2.2
  Bottom 0.4: IC1.34 14.75,17.07 v14.75,16
RA9  (via drill 0.4)
  Top 0.4: v18.5,1.45 v18.5,9.2
  Bottom 0.4: IC3.8 12.85,3.9 15.4,1.45 v18.5,1.45 | v18.5,9.2 18.5,10.8 15.8,13.75 14.75,13.75 13.25,15.25 13.25,16.73 IC1.35
RB2
  Top 0.4: U$118.1 U$75.1
  Bottom 0.4: U$118.1 27,16.75 27.75,17.5 27.75,18.75 26.25,20.25 26.25,21.25 25,22.75 23.16,22.75 IC1.23
RB3  (via drill 0.4)
  Top 0.4: v24.5,21.75 23.3,20.3 18.1,20.3 16.09,18.3 SW2.3
  Bottom 0.4: IC1.24 23.02,21.5 24.5,21.5 v24.5,21.75
RB4  (via drill 0.4)
  Top 0.4: 17.36,16 v17.25,16 17.36,16.11 SW2.4
  Bottom 0.4: IC1.33 17.25,17.07 v17.25,16
RB7
  Bottom 0.4: IC1.43 8.47,21 5,21 1.96,24.04 IC4.1
RB8  (via drill 0.4)
  Top 0.4: v3.25,16.5 3.25,19 4.75,20.5 v4.75,27
  Bottom 0.4: U$69.1 U$117.1 1,15.5 2,16.5 v3.25,16.5 | IC1.44 8.34,22 6.25,22 4.75,23.5 v4.75,27
RB9  (via drill 0.4)
  Top 0.4: SW2.16 8.46,25.55 v7,27
  Bottom 0.4: IC1.1 7.34,27 v7,27
RB10
  Bottom 0.4: IC1.8 10.92,31.34 U$9.2
RB11
  Bottom 0.4: IC1.9 12.2,31.19 12.2,34 U$9.3
RC0  (via drill 0.4)
  Top 0.4: v25.25,20.75 24.25,19.5 19.05,19.5 18.64,19.09 SW2.5
  Bottom 0.4: IC1.25 22.64,20.75 v25.25,20.75
RC1
  Bottom 0.4: IC1.26 22.26,20 24.5,20 SW1.3
RC8  (via drill 0.4)
  Top 0.4: v8.5,29.25 9.75,30.5 18,30.5 18.54,31.04 U$9.8
  Bottom 0.4: IC1.4 9.74,28 9.5,28 8.5,29 v8.5,29.25
RC9  (via drill 0.4)
  Top 0.4: v9.75,29 10.35,29.6 18.4,29.6 19.81,31 19.81,34 U$9.9
  Bottom 0.4: IC1.5 10.25,28.62 v9.75,29
TLP_R_LOW
  Top 0.4: U$7.P$1 24.28,48.75 TLP_R_LOW.6 24.25,48.82 24.25,50.25 25.5,51.5 27.25,51.5 28.25,52.5 28.25,55 | RP_R_LOW.1 27.5,55.5 28.25,55 | IC_R_LOW.3 28.2,54.95 28.25,55
VCAP/VDDCORE
  Bottom 0.4: IC1.7 9.12,32.01 U$15.1
VPP
  Top 0.4: $$U$13.4 12.55,10.15 14,11.6 18.2,11.6 19.91,13.21 SW2.6

### Text on the board
tPlace: + | -
bPlace: JP1 | P1 | JP1 | P2
Document: M1 | M2 | dsky md 1.0v | V B G Z A | A Z G B V | 5V | VPP | VDD | GND | 5V | RB8 | 3.3V | GND | AN4 | 3.3V | GND